# Altium project PcbIrda.PrjPCB
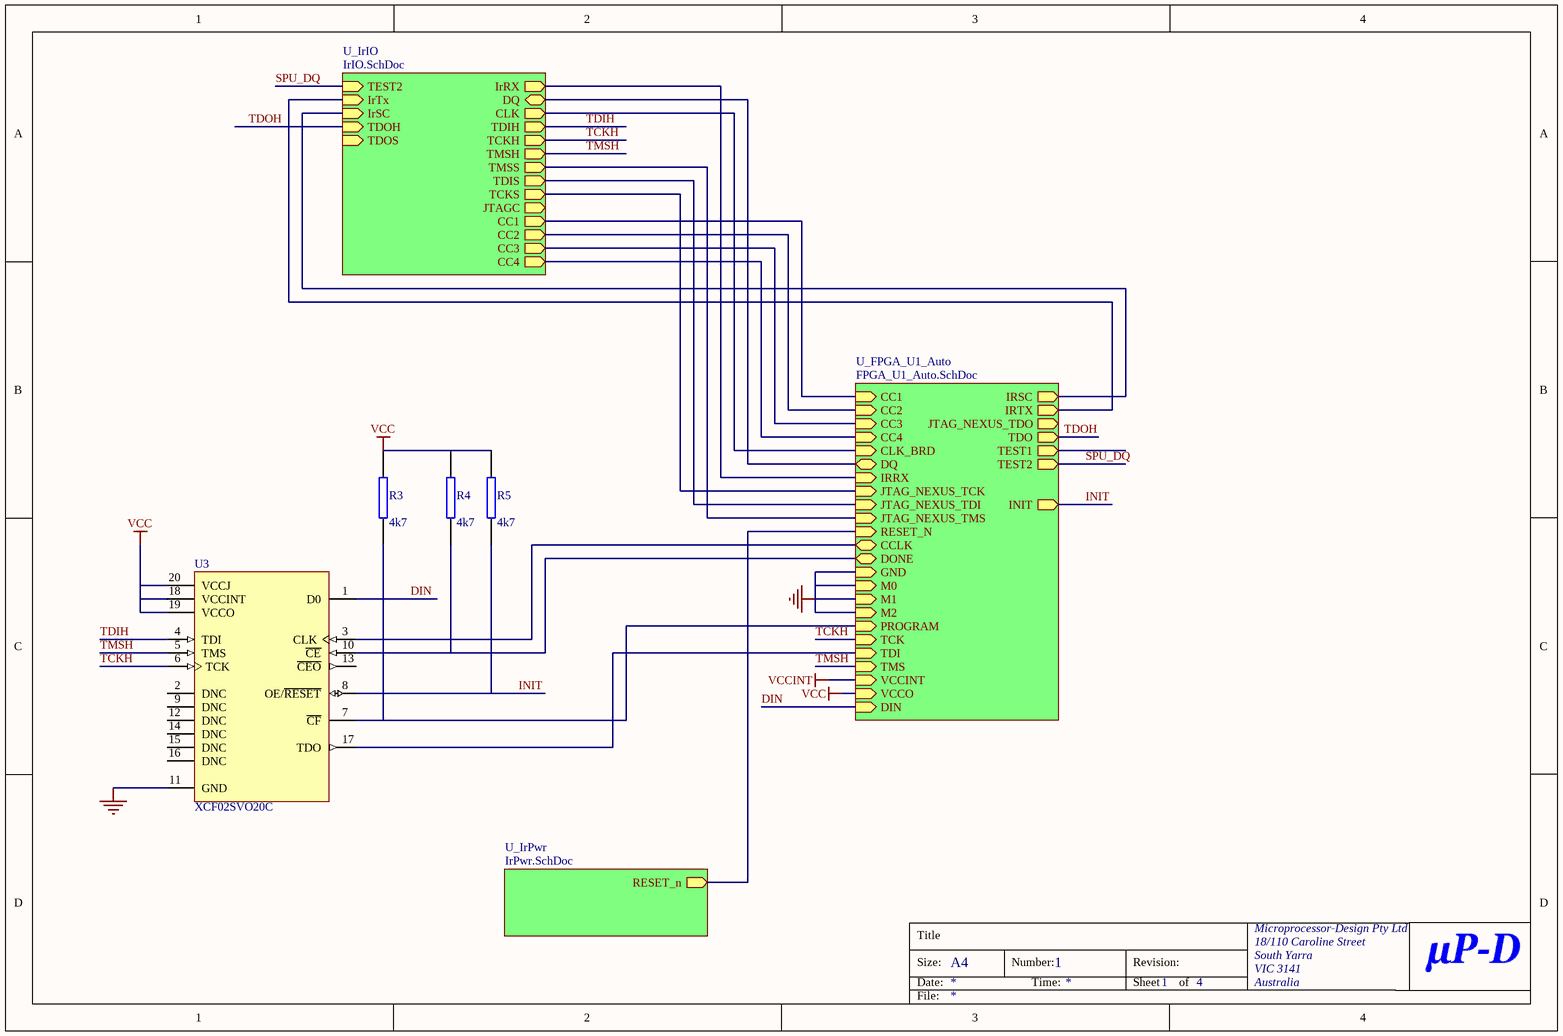
[diagram p0: TopPCB.SchDoc]
4 sheets, 52 parts. Net scope: hierarchical (ports join the sheet entries above them; power ports are global).
Board file: IRDA.PcbDoc
Sheets:
  TopPCB.SchDoc
    U_IrIO = IrIO.SchDoc
    U_IrPwr = IrPwr.SchDoc
    U_FPGA_U1_Auto = FPGA_U1_Auto.SchDoc

## Sheet TopPCB.SchDoc
size A4; Organization: Microprocessor-Design Pty Ltd; Address1: 18/110 Caroline Street; Address2: South Yarra; Address3: VIC 3141; Address4: Australia; DocumentNumber: 1; SheetNumber: 1; SheetTotal: 4

### Parts
R3  4k7  [M0603]
R4  4k7  [M0603]
R5  4k7  [M0603]
U3  XCF02SVO20C  [VO20]

### Sub-sheets
U_FPGA_U1_Auto = FPGA_U1_Auto.SchDoc: CC1 (in), CC2 (in), CC3 (in), CC4 (in), CLK_BRD (in), DIN (in), DQ (bidir), INIT (out), IRRX (in), IRSC (out), IRTX (out), JTAG_NEXUS_TCK (in), JTAG_NEXUS_TDI (in), JTAG_NEXUS_TDO (out), JTAG_NEXUS_TMS (in), RESET_N (in), TEST1 (out), TEST2 (out), CCLK (bidir), DONE (bidir), GND (in), M0 (in), M1 (in), M2 (in), PROGRAM (in), TCK (in), TDI (in), TDO (out), TMS (in), VCCINT (in), VCCO (in)
U_IrIO = IrIO.SchDoc: IrRX (out), DQ (bidir), TEST2 (in), IrTx (in), CLK (out), IrSC (in), TDIH (out), TCKH (out), TDOH (in), TMSH (out), TMSS (out), TDOS (in), TDIS (out), TCKS (out), JTAGC (out), CC1 (out), CC2 (out), CC3 (out), CC4 (out)
U_IrPwr = IrPwr.SchDoc: RESET_n (out)

### Nets
GND: U3.11(GND) ; sheet U_FPGA_U1_Auto/GND, sheet U_FPGA_U1_Auto/M0, sheet U_FPGA_U1_Auto/M1, sheet U_FPGA_U1_Auto/M2
VCC: R3.2 R4.2 R5.2 U3.18(VCCINT) U3.19(VCCO) U3.20(VCCJ) ; sheet U_FPGA_U1_Auto/VCCO  [project net VCCO]
CC1: sheet U_IrIO/CC1, sheet U_FPGA_U1_Auto/CC1
CC2: sheet U_IrIO/CC2, sheet U_FPGA_U1_Auto/CC2
CC3: sheet U_IrIO/CC3, sheet U_FPGA_U1_Auto/CC3
CC4: sheet U_IrIO/CC4, sheet U_FPGA_U1_Auto/CC4
CCLK: U3.3(CLK) ; sheet U_FPGA_U1_Auto/CCLK
CLK_BRD: sheet U_IrIO/CLK, sheet U_FPGA_U1_Auto/CLK_BRD
DIN: U3.1(D0) ; sheet U_FPGA_U1_Auto/DIN
DONE: R4.1 U3.10(~{CE}) ; sheet U_FPGA_U1_Auto/DONE
DQ: sheet U_IrIO/DQ, sheet U_FPGA_U1_Auto/DQ
INIT: R5.1 U3.8(OE/~{RESET}) ; sheet U_FPGA_U1_Auto/INIT
IrRX: sheet U_IrIO/IrRX, sheet U_FPGA_U1_Auto/IRRX
IrSC: sheet U_IrIO/IrSC, sheet U_FPGA_U1_Auto/IRSC
IrTX: sheet U_IrIO/IrTx, sheet U_FPGA_U1_Auto/IRTX
JTAG_NEXUS_TCK: sheet U_IrIO/TCKS, sheet U_FPGA_U1_Auto/JTAG_NEXUS_TCK
JTAG_NEXUS_TDI: sheet U_IrIO/TDIS, sheet U_FPGA_U1_Auto/JTAG_NEXUS_TDI
JTAG_NEXUS_TMS: sheet U_IrIO/TMSS, sheet U_FPGA_U1_Auto/JTAG_NEXUS_TMS
PROGRAM: R3.1 U3.7(~{CF}) ; sheet U_FPGA_U1_Auto/PROGRAM
RESET_n: sheet U_IrPwr/RESET_n, sheet U_FPGA_U1_Auto/RESET_N
SPU_DQ: sheet U_IrIO/TEST2, sheet U_FPGA_U1_Auto/TEST2
TCKH: U3.6(TCK) ; sheet U_IrIO/TCKH, sheet U_FPGA_U1_Auto/TCK  [project net TCK]
TDI: U3.17(TDO) ; sheet U_FPGA_U1_Auto/TDI
TDIH: U3.4(TDI) ; sheet U_IrIO/TDIH
TDOH: sheet U_IrIO/TDOH, sheet U_FPGA_U1_Auto/TDO  [project net TDO]
TMSH: U3.5(TMS) ; sheet U_IrIO/TMSH, sheet U_FPGA_U1_Auto/TMS  [project net TMS]

Not connected (* = marked no-connect by the designer): U3 2(DNC) 9(DNC) 12(DNC) 13(~{CEO}) 14(DNC) 15(DNC) 16(DNC)

### Notes on the sheet
- Title
- Size:
- Date:
- A4
- Number:
- Time:
- Revision:
- Sheet
- of
- File:

### Library data of the parts
R3-R5 = RES: SMT RESISTOR
U3 = XCF02SVO20C: XCF00S Series, Platform Flash In-System Programmable Configuration 3.3V PROM, 20-Pin TSOP, 2-Megabit, Commercial Grade; Manufacturer: Xilinx; Package Information: Latest Revision: ver1.0, May-2003; Code - JEDEC: MO-153-AC; Published: 17-Sep-2003; Datasheet: Latest Revision: ver1.1, Jun-2003; Package Reference: VO20; Publisher: Altium Limited

## Sheet IrIO.SchDoc: IrDA - Input/Output
size A4; Organization: Microprocessor-Design Pty Ltd; Address1: 18/110 Caroline Street; Address2: South Yarra; Address3: VIC 3141; Address4: Australia; DocumentNumber: 3; SheetNumber: 3; SheetTotal: 4
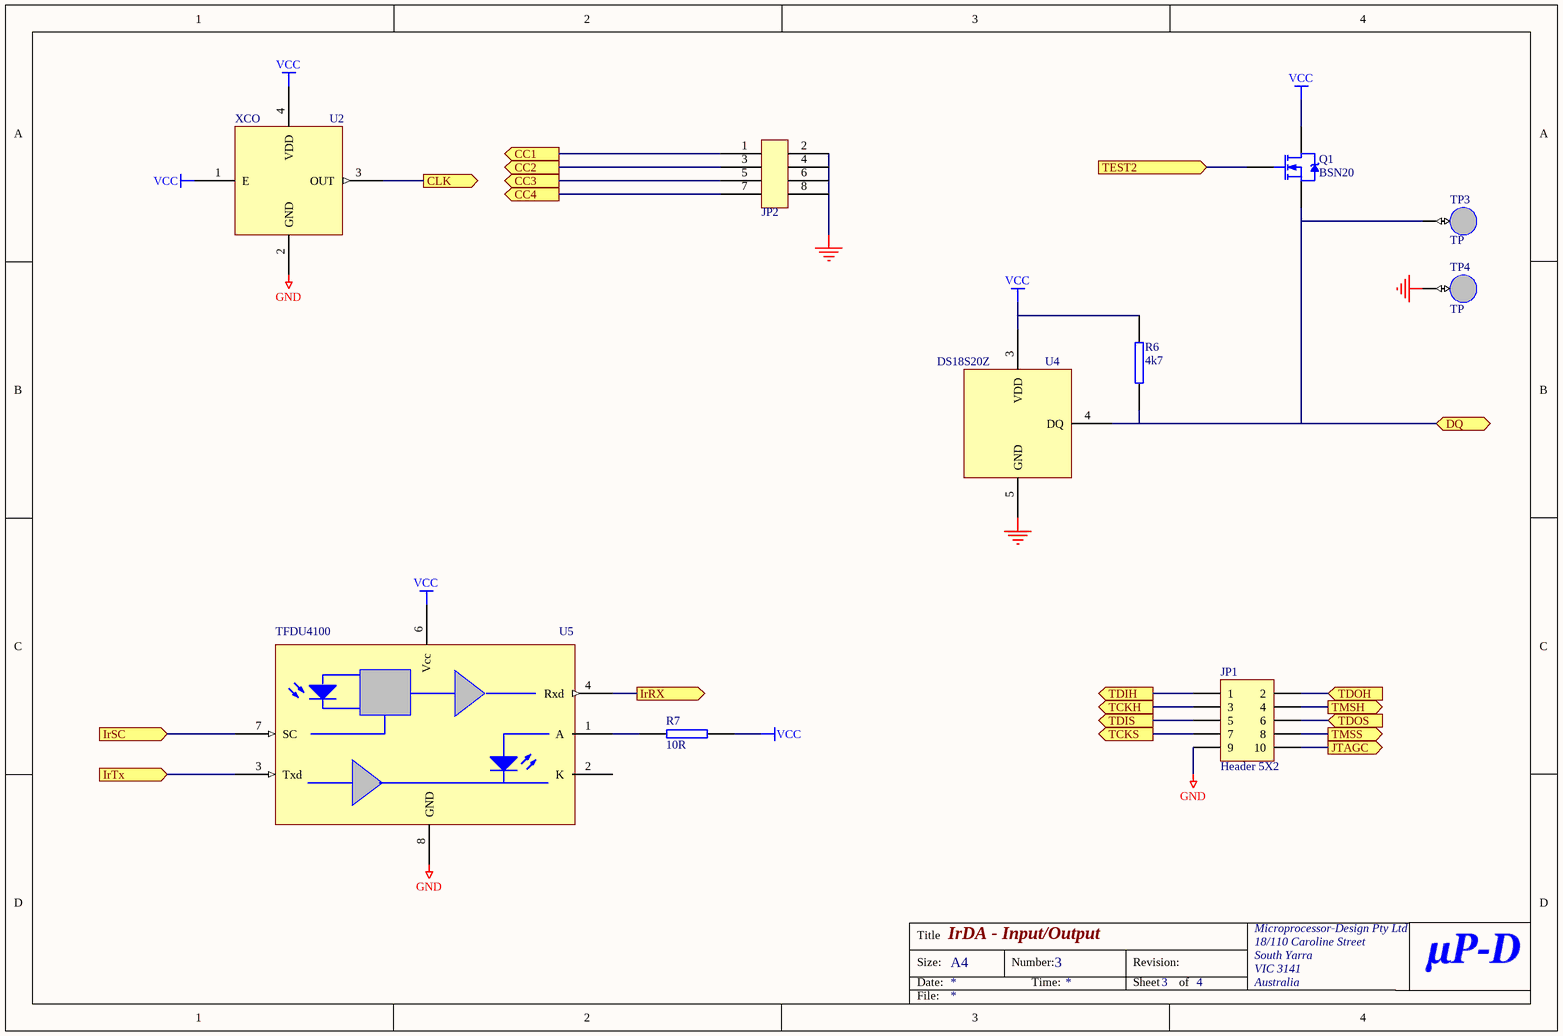
[diagram p1: IrIO.SchDoc]

### Parts
JP1  Header 5X2  [HDR2X5]
JP2  HDR4X2  [HDR4X2]  (value not drawn)
Q1  BSN20  [SOT23]
R6  4k7  [M0603]
R7  10R  [M0603]
TP3  TP  [TP]
TP4  TP  [TP]
U2  XCO  [QSMO-4200]
U4  DS18S20Z  [SO8]
U5  TFDU4100  [TDFU4100]

### Ports
CC1 (out), CC2 (out), CC3 (out), CC4 (out), CLK (out), DQ (bidir), IrRX (out), IrSC (in), IrTx (in), JTAGC (out), TCKH (out), TCKS (out), TDIH (out), TDIS (out), TDOH (in), TDOS (in), TEST2 (in), TMSH (out), TMSS (out)

### Nets
GND: JP1.9 JP2.2 JP2.4 JP2.6 JP2.8 TP4.1(test) U2.2(GND) U4.5(GND) U5.8(GND)
VCC: Q1.2(D) R6.2 R7.2 U2.1(E) U2.4(VDD) U4.3(VDD) U5.6(Vcc)  [project net VCCO]
CC1: JP2.1 ; port CC1
CC2: JP2.3 ; port CC2
CC3: JP2.5 ; port CC3
CC4: JP2.7 ; port CC4
CLK_BRD: U2.3(OUT) ; port CLK
DQ: Q1.3(S) R6.1 TP3.1(test) U4.4(DQ) ; port DQ
IrRX: U5.4(Rxd) ; port IrRX
IrSC: U5.7(SC) ; port IrSC
IrTX: U5.3(Txd) ; port IrTx
JTAG_NEXUS_TCK: JP1.7 ; port TCKS
JTAG_NEXUS_TDI: JP1.5 ; port TDIS
JTAG_NEXUS_TMS: JP1.8 ; port TMSS
SPU_DQ: Q1.1(G) ; port TEST2
TCK: JP1.3 ; port TCKH
TDIH: JP1.1 ; port TDIH
TDO: JP1.2 ; port TDOH
TMS: JP1.4 ; port TMSH
NetJP1_6: JP1.6 ; port TDOS
NetJP1_10: JP1.10 ; port JTAGC
NetR7_1: R7.1 U5.1(A)

Not connected (* = marked no-connect by the designer): U5 2(K)

### Notes on the sheet
- Title
- Size:
- Date:
- A4
- Number:
- Time:
- Revision:
- Sheet
- of
- File:

### Library data of the parts
JP1 = Header 5X2: Header, 5-Pin, Dual row; Manufacturer: Generic Components; Class I: Connector; Revision: July-2002: Re-released for DXP Platform.; Publisher: Altium Limited
JP2 = HDR4X2: HEADER 4X2 SQ PIN
Q1 = NMOSFET2
R6 R7 = RES: SMT RESISTOR
TP3 TP4 = TP: SMALL PAD
U5 = TDFU4100: IrDA TxRx; Mfr: Vishay

## Sheet IrPwr.SchDoc: IrDA - Power
size A4; Organization: Microprocessor-Design Pty Ltd; Address1: 18/110 Caroline Street; Address2: South Yarra; Address3: VIC 3141; Address4: Australia; DocumentNumber: 2; SheetNumber: 2; SheetTotal: 4
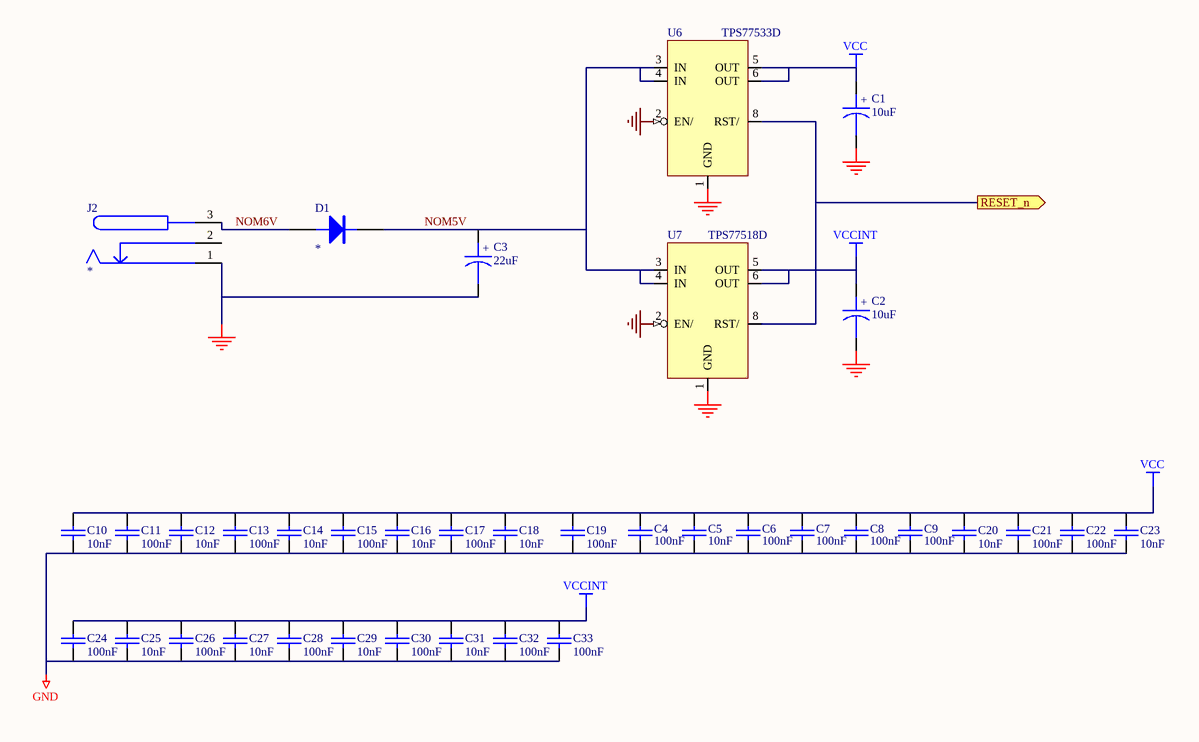
[diagram p2: IrPwr.SchDoc]

### Parts
C1  10uF  [3216POL]
C2  10uF  [3216POL]
C3  22uF  [3216POL]
C4  100nF  [M0603]
C5  10nF  [M0603]
C6  100nF  [M0603]
C7  100nF  [M0603]
C8  100nF  [M0603]
C9  100nF  [M0603]
C10  10nF  [M0603]
C11  100nF  [M0603]
C12  10nF  [M0603]
C13  100nF  [M0603]
C14  10nF  [M0603]
C15  100nF  [M0603]
C16  10nF  [M0603]
C17  100nF  [M0603]
C18  10nF  [M0603]
C19  100nF  [M0603]
C20  10nF  [M0603]
C21  100nF  [M0603]
C22  100nF  [M0603]
C23  10nF  [M0603]
C24  100nF  [M0603]
C25  10nF  [M0603]
C26  100nF  [M0603]
C27  10nF  [M0603]
C28  100nF  [M0603]
C29  10nF  [M0603]
C30  100nF  [M0603]
C31  10nF  [M0603]
C32  100nF  [M0603]
C33  100nF  [M0603]
D1  *  [SOT23]
J2  *  [DC-SOCKET]
U6  TPS77533D  [SO8]
U7  TPS77518D  [SO8]

### Ports
RESET_n (out)

### Nets
GND: C1.2 C2.2 C3.2 C4.2 C5.2 C6.2 C7.2 C8.2 C9.2 C10.2 C11.2 C12.2 C13.2 C14.2 C15.2 C16.2 C17.2 C18.2 C19.2 C20.2 C21.2 C22.2 C23.2 C24.2 C25.2 C26.2 C27.2 C28.2 C29.2 C30.2 C31.2 C32.2 C33.2 J2.1(SHELL) U6.1(GND) U6.2(EN/) U7.1(GND) U7.2(EN/)
VCC: C1.1 C4.1 C5.1 C6.1 C7.1 C8.1 C9.1 C10.1 C11.1 C12.1 C13.1 C14.1 C15.1 C16.1 C17.1 C18.1 C19.1 C20.1 C21.1 C22.1 C23.1 U6.5(OUT) U6.6(OUT)  [project net VCCO]
VCCINT: C2.1 C24.1 C25.1 C26.1 C27.1 C28.1 C29.1 C30.1 C31.1 C32.1 C33.1 U7.5(OUT) U7.6(OUT)
NOM5V: C3.1 D1.2(K) U6.3(IN) U6.4(IN) U7.3(IN) U7.4(IN)
NOM6V: D1.1(A) J2.3(CENTRE)
RESET_n: U6.8(RST/) U7.8(RST/) ; port RESET_n

Not connected (* = marked no-connect by the designer): J2 2(CNTCT)

### Notes on the sheet
- Title
- Size:
- Date:
- A4
- Number:
- Time:
- Revision:
- Sheet
- of
- File:
- (in symbol CAPACITOR-POL) +

### Library data of the parts
C1-C3 = CAPACITOR-POL: ELECTROLYTIC/TANTALUM CAP
C4-C33 = CAP: Cap 0603; Text Field1: A TEXT FIELD
D1 = DIODE
J2 = DC-SOCKET: Switchcraft RASM712,Kycon KLD-SMT-0201
U6 U7 = TPS77518D: LDO 1V8 500mA

## Sheet FPGA_U1_Auto.SchDoc
size A3; Organization: Microprocessor-Design Pty Ltd; Address1: 18/110 Caroline Street; Address2: South Yarra; Address3: VIC 3141; Address4: Australia; DocumentNumber: 4; SheetNumber: 4; SheetTotal: 4; Generated From FPGA Project: SoIrDA.PrjFpg; UNUSED_SPECIAL: NoERC; UNUSED_IO: NoERC; VREF: NoERC; UNUSED_INPUT: NoERC
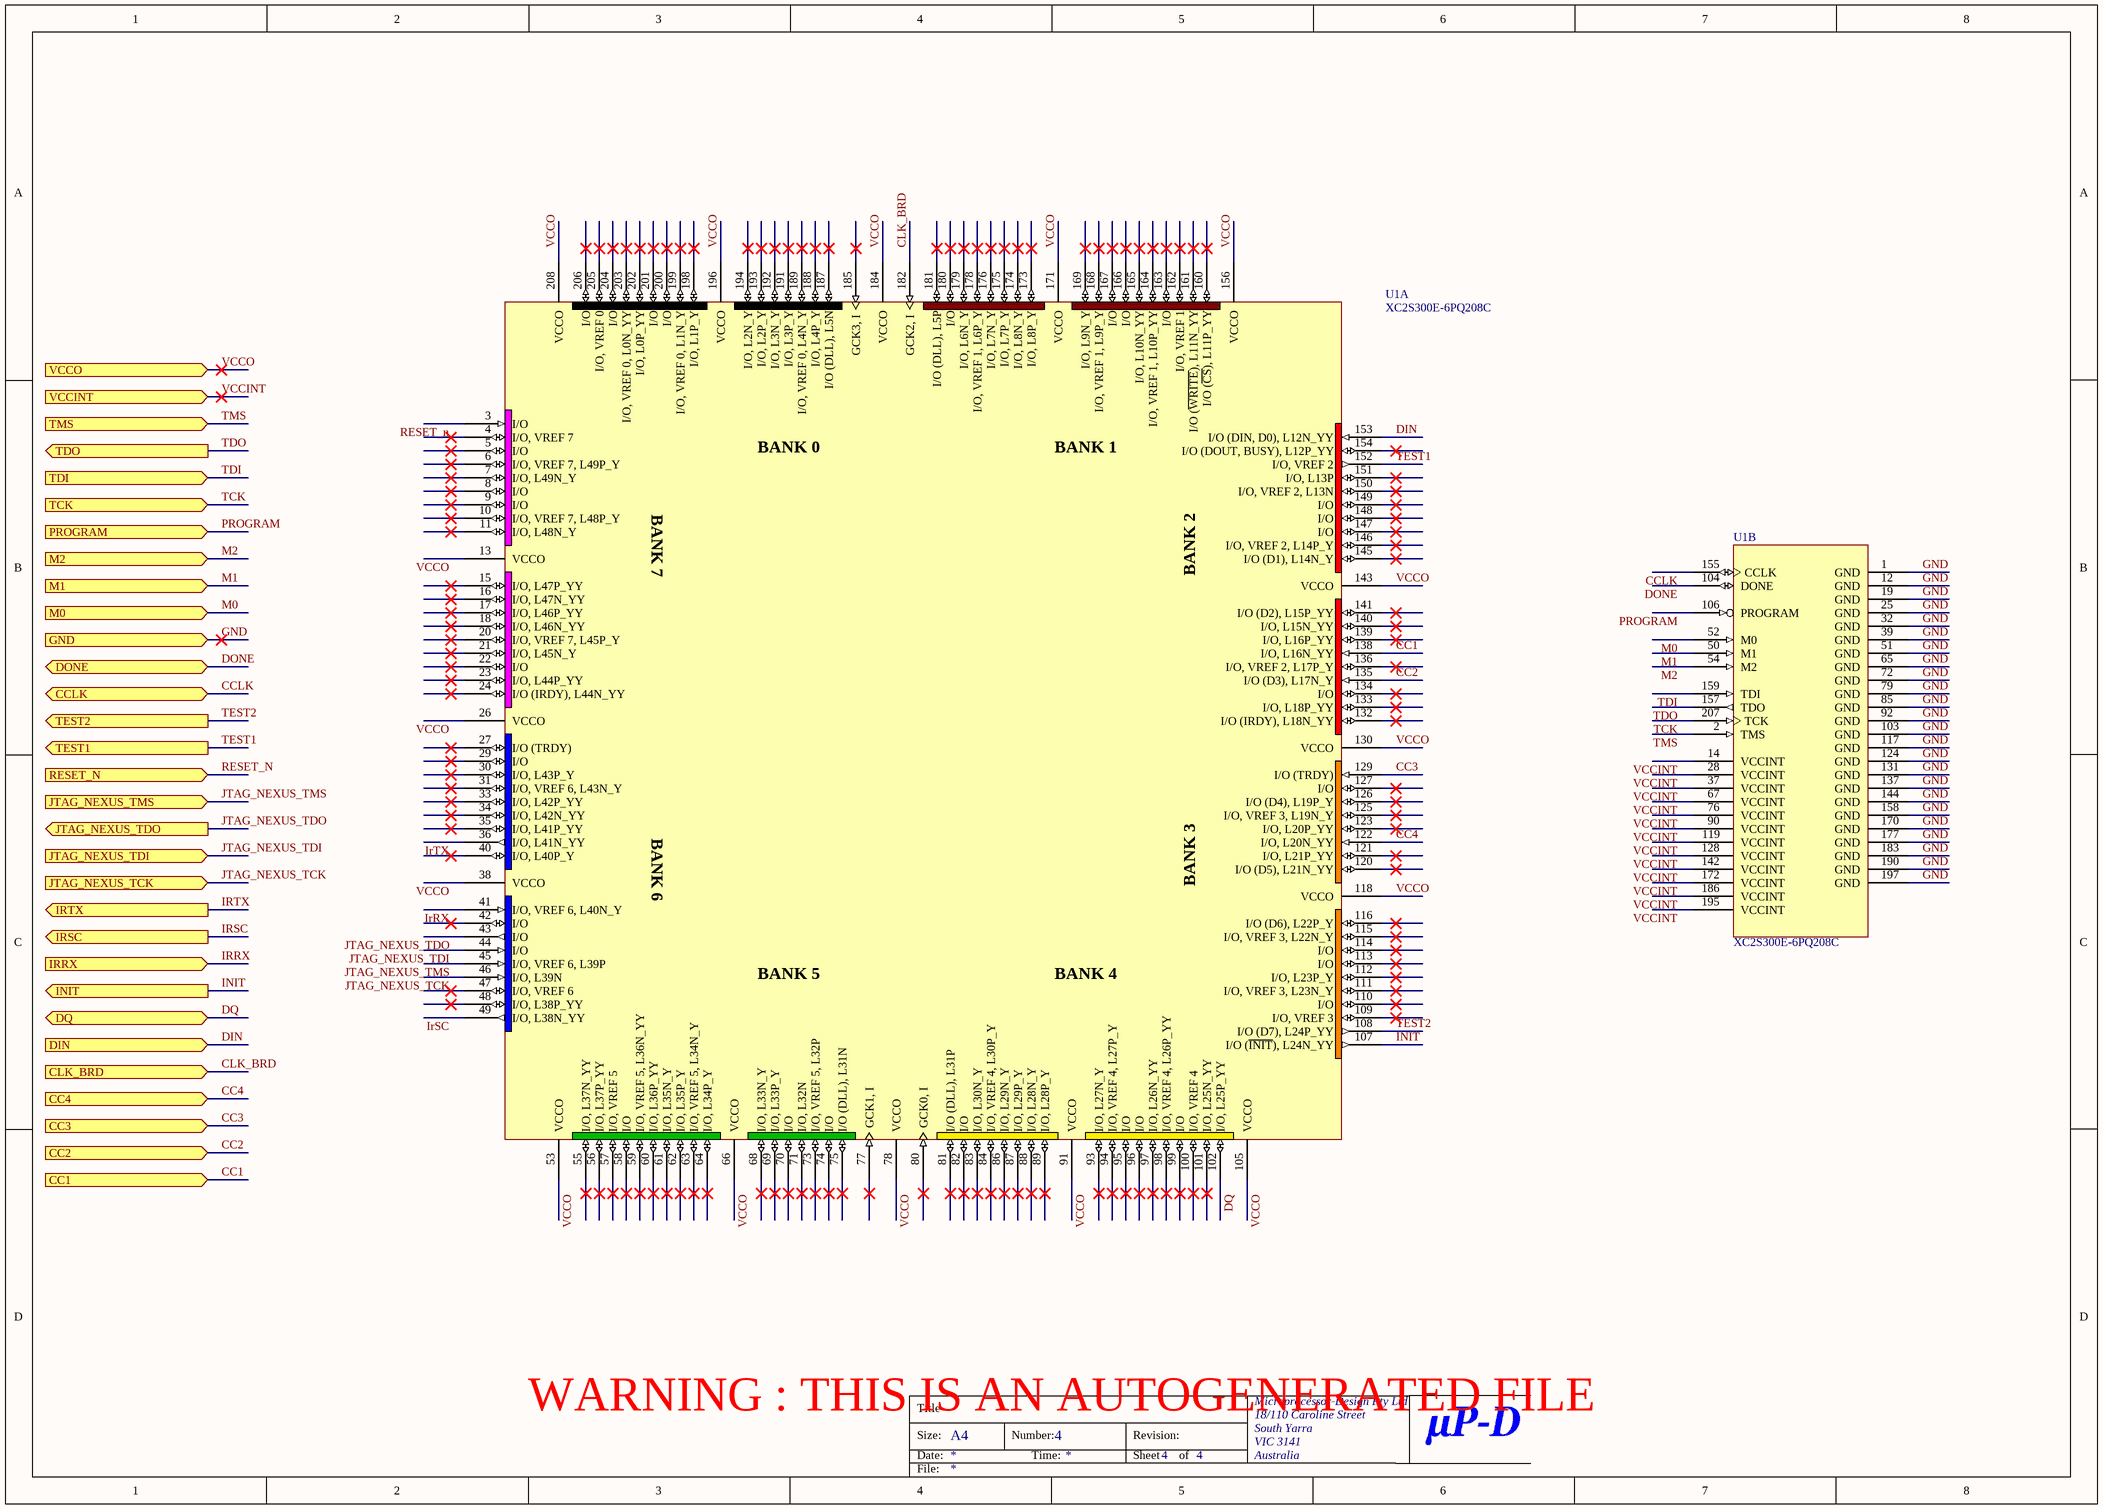
[diagram p3: FPGA_U1_Auto.SchDoc]

### Parts
U1  XC2S300E-6PQ208C  [PQ208]  (parts A,B of 2)

### Ports
CC1 (in), CC2 (in), CC3 (in), CC4 (in), CCLK (bidir), CLK_BRD (in), DIN (in), DONE (bidir), DQ (bidir), GND (in), INIT (out), IRRX (in), IRSC (out), IRTX (out), JTAG_NEXUS_TCK (in), JTAG_NEXUS_TDI (in), JTAG_NEXUS_TDO (out), JTAG_NEXUS_TMS (in), M0 (in), M1 (in), M2 (in), PROGRAM (in), RESET_N (in), TCK (in), TDI (in), TDO (out), TEST1 (out), TEST2 (out), TMS (in), VCCINT (in), VCCO (in)

### Nets
GND: U1.1(GND) U1.12(GND) U1.19(GND) U1.25(GND) U1.32(GND) U1.39(GND) U1.50(M1) U1.51(GND) U1.52(M0) U1.54(M2) U1.65(GND) U1.72(GND) U1.79(GND) U1.85(GND) U1.92(GND) U1.103(GND) U1.117(GND) U1.124(GND) U1.131(GND) U1.137(GND) U1.144(GND) U1.158(GND) U1.170(GND) U1.177(GND) U1.183(GND) U1.190(GND) U1.197(GND) ; port GND, port M0, port M1, port M2  [also labelled M0, M1, M2]
VCCINT: U1.14(VCCINT) U1.28(VCCINT) U1.37(VCCINT) U1.67(VCCINT) U1.76(VCCINT) U1.90(VCCINT) U1.119(VCCINT) U1.128(VCCINT) U1.142(VCCINT) U1.172(VCCINT) U1.186(VCCINT) U1.195(VCCINT) ; port VCCINT
VCCO: U1.13(VCCO) U1.26(VCCO) U1.38(VCCO) U1.53(VCCO) U1.66(VCCO) U1.78(VCCO) U1.91(VCCO) U1.105(VCCO) U1.118(VCCO) U1.130(VCCO) U1.143(VCCO) U1.156(VCCO) U1.171(VCCO) U1.184(VCCO) U1.196(VCCO) U1.208(VCCO) ; port VCCO
CC1: U1.138(I/O,_L16N_YY) ; port CC1
CC2: U1.135(I/O_(D3),_L17N_Y) ; port CC2
CC3: U1.129(I/O_(TRDY)) ; port CC3
CC4: U1.122(I/O,_L20N_YY) ; port CC4
CCLK: U1.155(CCLK) ; port CCLK
CLK_BRD: U1.182(GCK2,_I) ; port CLK_BRD
DIN: U1.153(I/O_(DIN,_D0),_L12N_YY) ; port DIN
DONE: U1.104(DONE) ; port DONE
DQ: U1.102(I/O,_L25P_YY) ; port DQ
INIT: U1.107(I/O_(~{INIT}),_L24N_YY) ; port INIT
IrRX: U1.41(I/O,_VREF_6,_L40N_Y) ; port IRRX
IrSC: U1.49(I/O,_L38N_YY) ; port IRSC
IrTX: U1.36(I/O,_L41N_YY) ; port IRTX
JTAG_NEXUS_TCK: U1.46(I/O,_L39N) ; port JTAG_NEXUS_TCK
JTAG_NEXUS_TDI: U1.44(I/O) ; port JTAG_NEXUS_TDI
JTAG_NEXUS_TDO: U1.43(I/O) ; port JTAG_NEXUS_TDO
JTAG_NEXUS_TMS: U1.45(I/O,_VREF_6,_L39P) ; port JTAG_NEXUS_TMS
PROGRAM: U1.106(PROGRAM) ; port PROGRAM
RESET_n: U1.3(I/O) ; port RESET_N
TCK: U1.207(TCK) ; port TCK
TDI: U1.159(TDI) ; port TDI
TDO: U1.157(TDO) ; port TDO
TEST1: U1.152(I/O,_VREF_2) ; port TEST1
TEST2: U1.108(I/O_(D7),_L24P_YY) ; port TEST2  [project net SPU_DQ]
TMS: U1.2(TMS) ; port TMS

Not connected (* = marked no-connect by the designer): U1 4(I/O,_VREF_7)* 5(I/O)* 6(I/O,_VREF_7,_L49P_Y)* 7(I/O,_L49N_Y)* 8(I/O)* 9(I/O)* 10(I/O,_VREF_7,_L48P_Y)* 11(I/O,_L48N_Y)* 15(I/O,_L47P_YY)* 16(I/O,_L47N_YY)* 17(I/O,_L46P_YY)* 18(I/O,_L46N_YY)* 20(I/O,_VREF_7,_L45P_Y)* 21(I/O,_L45N_Y)* 22(I/O)* 23(I/O,_L44P_YY)* 24(I/O_(IRDY),_L44N_YY)* 27(I/O_(TRDY))* 29(I/O)* 30(I/O,_L43P_Y)* 31(I/O,_VREF_6,_L43N_Y)* 33(I/O,_L42P_YY)* 34(I/O,_L42N_YY)* 35(I/O,_L41P_YY)* 40(I/O,_L40P_Y)* 42(I/O)* 47(I/O,_VREF_6)* 48(I/O,_L38P_YY)* 55(I/O,_L37N_YY)* 56(I/O,_L37P_YY)* 57(I/O,_VREF_5)* 58(I/O)* 59(I/O,_VREF_5,_L36N_YY)* 60(I/O,_L36P_YY)* 61(I/O,_L35N_Y)* 62(I/O,_L35P_Y)* 63(I/O,_VREF_5,_L34N_Y)* 64(I/O,_L34P_Y)* 68(I/O,_L33N_Y)* 69(I/O,_L33P_Y)* 70(I/O)* 71(I/O,_L32N)* 73(I/O,_VREF_5,_L32P)* 74(I/O)* 75(I/O_(DLL),_L31N)* 77(GCK1,_I)* 80(GCK0,_I)* 81(I/O_(DLL),_L31P)* 82(I/O)* 83(I/O,_L30N_Y)* 84(I/O,_VREF_4,_L30P_Y)* 86(I/O,_L29N_Y)* 87(I/O,_L29P_Y)* 88(I/O,_L28N_Y)* 89(I/O,_L28P_Y)* 93(I/O,_L27N_Y)* 94(I/O,_VREF_4,_L27P_Y)* 95(I/O)* 96(I/O)* 97(I/O,_L26N_YY)* 98(I/O,_VREF_4,_L26P_YY)* 99(I/O)* 100(I/O,_VREF_4)* 101(I/O,_L25N_YY)* 109(I/O,_VREF_3)* 110(I/O)* 111(I/O,_VREF_3,_L23N_Y)* 112(I/O,_L23P_Y)* 113(I/O)* 114(I/O)* 115(I/O,_VREF_3,_L22N_Y)* 116(I/O_(D6),_L22P_Y)* 120(I/O_(D5),_L21N_YY)* 121(I/O,_L21P_YY)* 123(I/O,_L20P_YY)* 125(I/O,_VREF_3,_L19N_Y)* 126(I/O_(D4),_L19P_Y)* 127(I/O)* 132(I/O_(IRDY),_L18N_YY)* 133(I/O,_L18P_YY)* 134(I/O)* 136(I/O,_VREF_2,_L17P_Y)* 139(I/O,_L16P_YY)* 140(I/O,_L15N_YY)* 141(I/O_(D2),_L15P_YY)* 145(I/O_(D1),_L14N_Y)* 146(I/O,_VREF_2,_L14P_Y)* 147(I/O)* 148(I/O)* 149(I/O)* 150(I/O,_VREF_2,_L13N)* 151(I/O,_L13P)* 154(I/O_(DOUT,_BUSY),_L12P_YY)* 160(I/O_(~{CS}),_L11P_YY)* 161(I/O_(~{WRITE}),_L11N_YY)* 162(I/O,_VREF_1)* 163(I/O)* 164(I/O,_VREF_1,_L10P_YY)* 165(I/O,_L10N_YY)* 166(I/O)* 167(I/O)* 168(I/O,_VREF_1,_L9P_Y)* 169(I/O,_L9N_Y)* 173(I/O,_L8P_Y)* 174(I/O,_L8N_Y)* 175(I/O,_L7P_Y)* 176(I/O,_L7N_Y)* 178(I/O,_VREF_1,_L6P_Y)* 179(I/O,_L6N_Y)* 180(I/O)* 181(I/O_(DLL),_L5P)* 185(GCK3,_I)* 187(I/O_(DLL),_L5N)* 188(I/O,_L4P_Y)* 189(I/O,_VREF_0,_L4N_Y)* 191(I/O,_L3P_Y)* 192(I/O,_L3N_Y)* 193(I/O,_L2P_Y)* 194(I/O,_L2N_Y)* 198(I/O,_L1P_Y)* 199(I/O,_VREF_0,_L1N_Y)* 200(I/O)* 201(I/O)* 202(I/O,_L0P_YY)* 203(I/O,_VREF_0,_L0N_YY)* 204(I/O)* 205(I/O,_VREF_0)* 206(I/O)*

### Notes on the sheet
- WARNING : THIS IS AN AUTOGENERATED FILE
- Title
- Size:
- Date:
- A4
- Number:
- Time:
- Revision:
- Sheet
- of
- File:
- (in symbol XC2S300E-6PQ208C, part A) BANK 0; BANK 1; BANK 7; BANK 2; BANK 6; BANK 3; BANK 5; BANK 4

### Library data of the parts
U1 = XC2S300E-6PQ208C: Spartan-IIE 1.8V FPGA, 208-Pin PQFP, Standard Performance, Commercial Grade; Package Information: Latest Revision: ver1.1, Oct-2002; Code - JEDEC: MS-029-FA-1; Published: 19-Jul-2002; Revision: 17-Sep-2003: Pin names updated to match datasheet, ver2.1.; Datasheet: Latest Revision: 09-Jul-2003; Package Reference: PQ208; Publisher: Altium Limited

## Nets that join several sheets
GND: TopPCB (U3.11), IrIO (9 pins), IrPwr (38 pins), FPGA_U1_Auto (27 pins)
VCCINT: IrPwr (13 pins), FPGA_U1_Auto (12 pins)
VCCO: TopPCB (6 pins), IrIO (7 pins), IrPwr (23 pins), FPGA_U1_Auto (16 pins)
CC1: IrIO (JP2.1), FPGA_U1_Auto (U1.138)
CC2: IrIO (JP2.3), FPGA_U1_Auto (U1.135)
CC3: IrIO (JP2.5), FPGA_U1_Auto (U1.129)
CC4: IrIO (JP2.7), FPGA_U1_Auto (U1.122)
CCLK: TopPCB (U3.3), FPGA_U1_Auto (U1.155)
CLK_BRD: IrIO (U2.3), FPGA_U1_Auto (U1.182)
DIN: TopPCB (U3.1), FPGA_U1_Auto (U1.153)
DONE: TopPCB (R4.1 U3.10), FPGA_U1_Auto (U1.104)
DQ: IrIO (Q1.3 R6.1 TP3.1 U4.4), FPGA_U1_Auto (U1.102)
INIT: TopPCB (R5.1 U3.8), FPGA_U1_Auto (U1.107)
IrRX: IrIO (U5.4), FPGA_U1_Auto (U1.41)
IrSC: IrIO (U5.7), FPGA_U1_Auto (U1.49)
IrTX: IrIO (U5.3), FPGA_U1_Auto (U1.36)
JTAG_NEXUS_TCK: IrIO (JP1.7), FPGA_U1_Auto (U1.46)
JTAG_NEXUS_TDI: IrIO (JP1.5), FPGA_U1_Auto (U1.44)
JTAG_NEXUS_TMS: IrIO (JP1.8), FPGA_U1_Auto (U1.45)
PROGRAM: TopPCB (R3.1 U3.7), FPGA_U1_Auto (U1.106)
RESET_n: IrPwr (U6.8 U7.8), FPGA_U1_Auto (U1.3)
SPU_DQ: IrIO (Q1.1), FPGA_U1_Auto (U1.108)
TCK: TopPCB (U3.6), IrIO (JP1.3), FPGA_U1_Auto (U1.207)
TDI: TopPCB (U3.17), FPGA_U1_Auto (U1.159)
TDIH: TopPCB (U3.4), IrIO (JP1.1)
TDO: IrIO (JP1.2), FPGA_U1_Auto (U1.157)
TMS: TopPCB (U3.5), IrIO (JP1.4), FPGA_U1_Auto (U1.2)